# EAGLE schematic control_board (EAGLE 9.6.2)
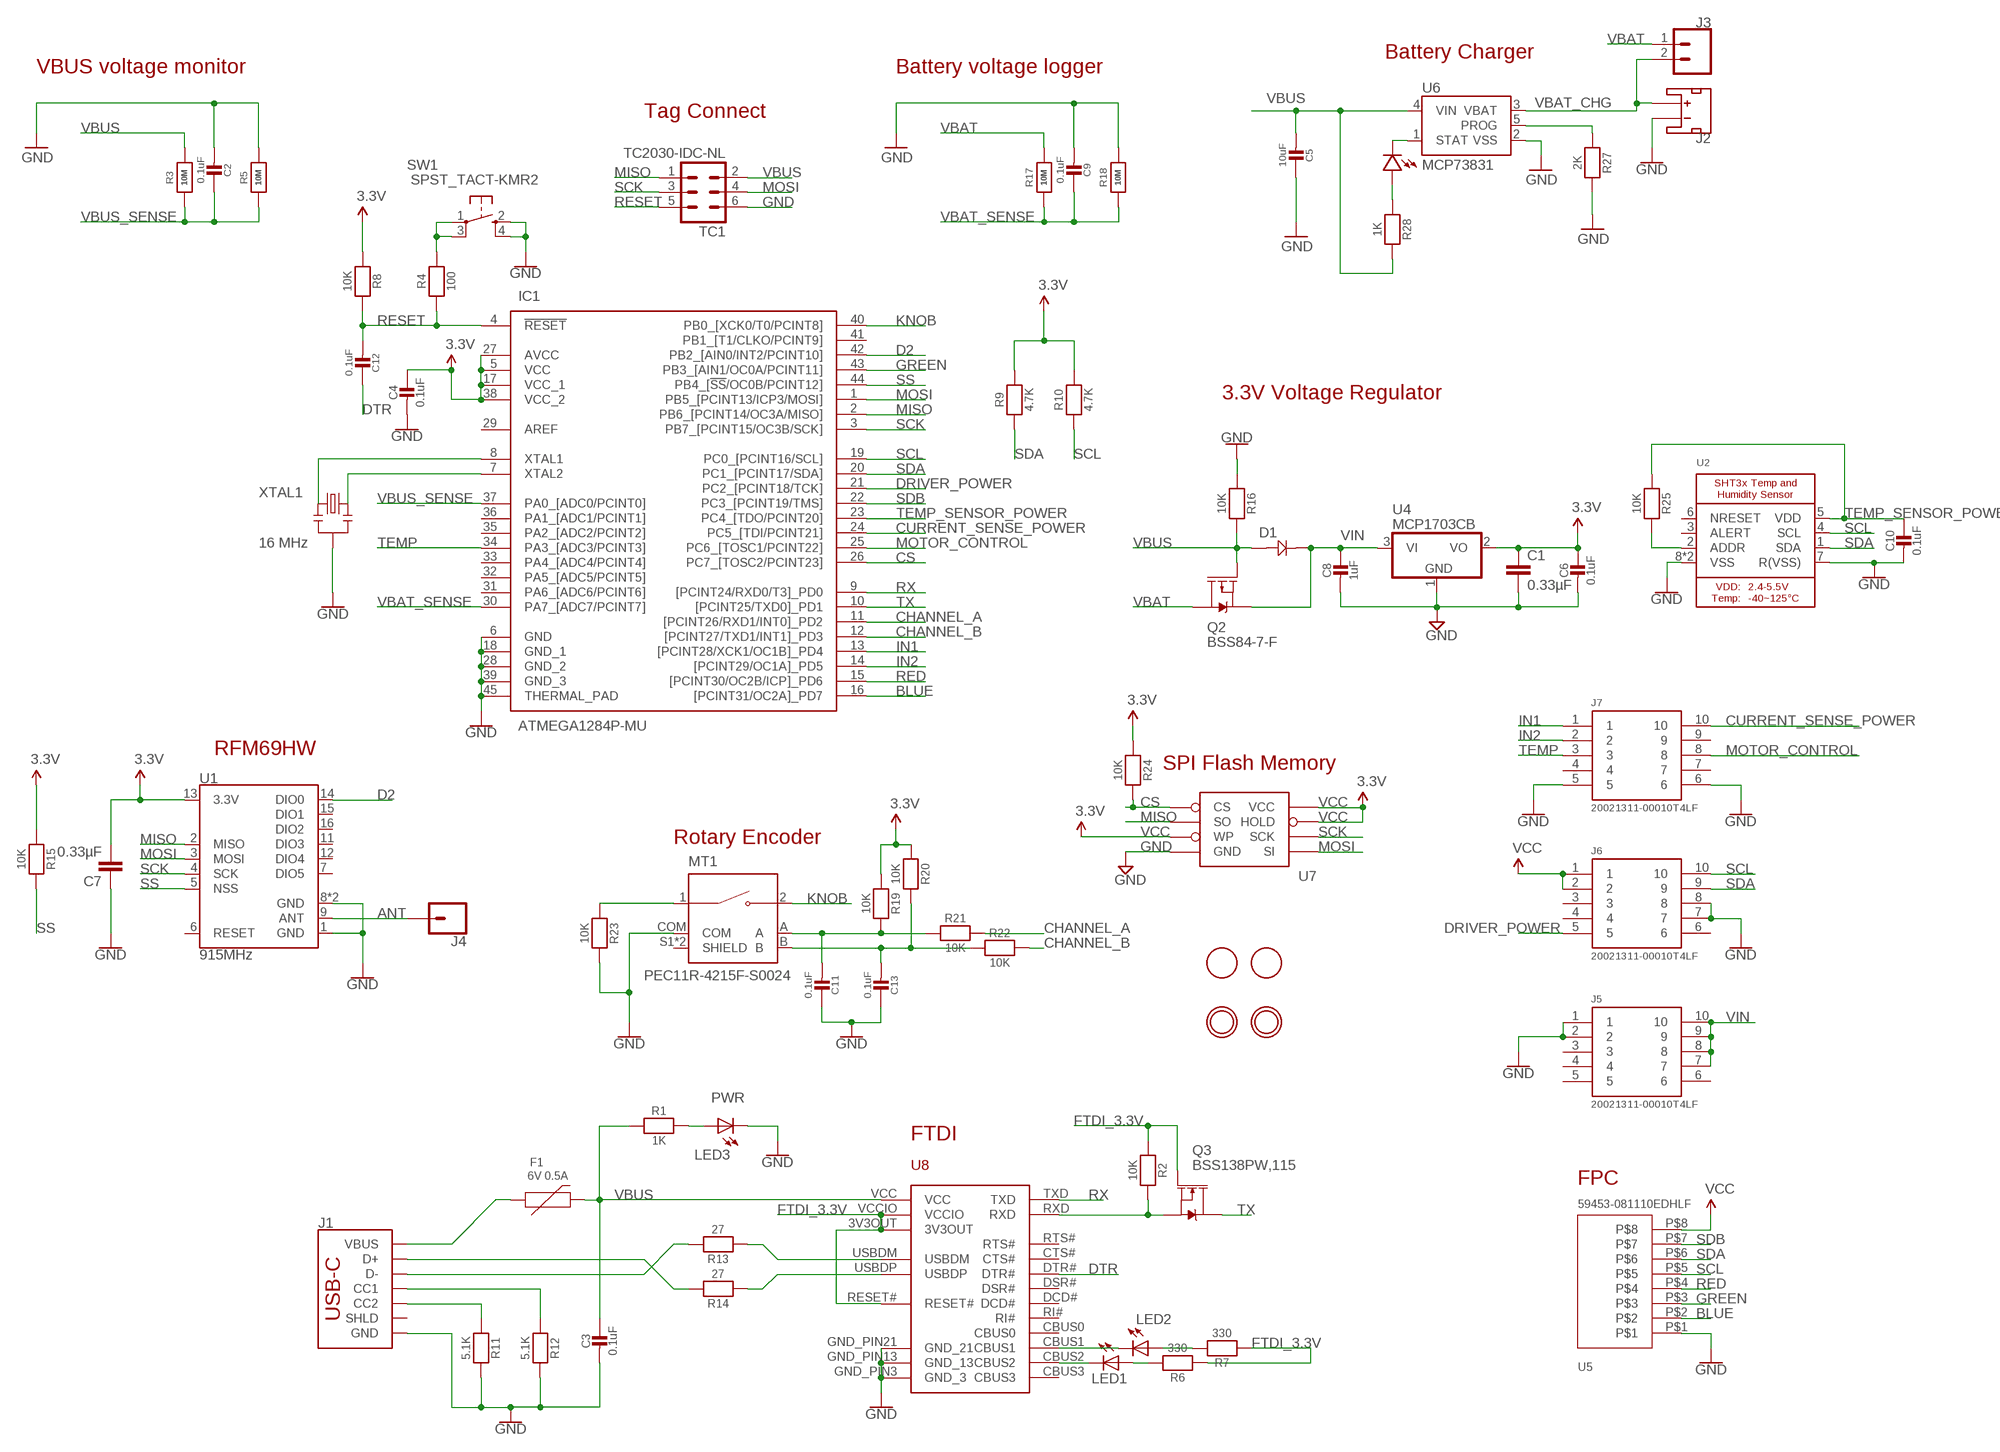
[diagram p0: schematic, sheet 1]

## Parts
C1  0.33µF  0.33UF/330NF-0805-50V-10%  [0805]
C2  0.1uF  MICROBUILDER_CAP_CERAMIC_0402MP  [MICROBUILDER__0402MP]
C3  0.1uF  MICROBUILDER_CAP_CERAMIC_0402MP  [MICROBUILDER__0402MP]
C4  0.1uF  MICROBUILDER_CAP_CERAMIC_0402MP  [MICROBUILDER__0402MP]
C5  10uF  MICROBUILDER_CAP_CERAMIC_0402MP  [MICROBUILDER__0402MP]
C6  0.1uF  MICROBUILDER_CAP_CERAMIC_0402MP  [MICROBUILDER__0402MP]
C7  0.33µF  0.33UF/330NF-0805-50V-10%  [0805]
C8  1uF  MICROBUILDER_CAP_CERAMIC_0402MP  [MICROBUILDER__0402MP]
C9  0.1uF  MICROBUILDER_CAP_CERAMIC_0402MP  [MICROBUILDER__0402MP]
C10  0.1uF  MICROBUILDER_CAP_CERAMIC_0402MP  [MICROBUILDER__0402MP]
C11  0.1uF  MICROBUILDER_CAP_CERAMIC_0402MP  [MICROBUILDER__0402MP]
C12  0.1uF  MICROBUILDER_CAP_CERAMIC_0402MP  [MICROBUILDER__0402MP]
C13  0.1uF  MICROBUILDER_CAP_CERAMIC_0402MP  [MICROBUILDER__0402MP]
D1  DIODE_SCHOTTKY0805-RES  [0805]
F1  6V 0.5A  PPTC_6V500MA  [0805]
IC1  ATMEGA1284P-MU  [QFN50P700X700X100-45N]
J1  USB Female Type C Connector  USB_C_2-LAYER_PADS  [USB-C-16P-2LAYER-PADS]
J2  JST_2MM_MALE  [JST-2-SMD]
J3  CONN_02  [1X02]
J4  CONN_01  [1X01]
J5  20021311-00010T4LF  [HEADER_1.27MM_2X5]
J6  20021311-00010T4LF  [HEADER_1.27MM_2X5]
J7  20021311-00010T4LF  [HEADER_1.27MM_2X5]
LED1  LEDCHIPLED_0603  [CHIPLED_0603]
LED2  LEDCHIPLED_0603  [CHIPLED_0603]
LED3  PWR  LEDCHIPLED_0603  [CHIPLED_0603]
LED4  LED0603  [0603-LED]
MT1  PEC11R-4215F-S0024  [XDCR_PEC11R-4215F-S0024]
Q2  BSS84-7-F  MOSFET-PCH-BSS84  [SOT23-3]
Q3  BSS138PW,115  MOSFET-NCH-BSS138PW,115  [SOT323]
R1  1K  MICROBUILDER_RESISTOR_0402MP  [MICROBUILDER__0402MP]
R2  10K  MICROBUILDER_RESISTOR_0402MP  [MICROBUILDER__0402MP]
R3  10M  MICROBUILDER_RESISTOR_0402MP  [MICROBUILDER__0402MP]
R4  100  MICROBUILDER_RESISTOR_0402MP  [MICROBUILDER__0402MP]
R5  10M  MICROBUILDER_RESISTOR_0402MP  [MICROBUILDER__0402MP]
R6  330  MICROBUILDER_RESISTOR_0402MP  [MICROBUILDER__0402MP]
R7  330  MICROBUILDER_RESISTOR_0402MP  [MICROBUILDER__0402MP]
R8  10K  MICROBUILDER_RESISTOR_0402MP  [MICROBUILDER__0402MP]
R9  4.7K  MICROBUILDER_RESISTOR_0402MP  [MICROBUILDER__0402MP]
R10  4.7K  MICROBUILDER_RESISTOR_0402MP  [MICROBUILDER__0402MP]
R11  5.1K  MICROBUILDER_RESISTOR_0402MP  [MICROBUILDER__0402MP]
R12  5.1K  MICROBUILDER_RESISTOR_0402MP  [MICROBUILDER__0402MP]
R13  27  MICROBUILDER_RESISTOR_0402MP  [MICROBUILDER__0402MP]
R14  27  MICROBUILDER_RESISTOR_0402MP  [MICROBUILDER__0402MP]
R15  10K  MICROBUILDER_RESISTOR_0402MP  [MICROBUILDER__0402MP]
R16  10K  MICROBUILDER_RESISTOR_0402MP  [MICROBUILDER__0402MP]
R17  10M  MICROBUILDER_RESISTOR_0402MP  [MICROBUILDER__0402MP]
R18  10M  MICROBUILDER_RESISTOR_0402MP  [MICROBUILDER__0402MP]
R19  10K  MICROBUILDER_RESISTOR_0402MP  [MICROBUILDER__0402MP]
R20  10K  MICROBUILDER_RESISTOR_0402MP  [MICROBUILDER__0402MP]
R21  10K  MICROBUILDER_RESISTOR_0402MP  [MICROBUILDER__0402MP]
R22  10K  MICROBUILDER_RESISTOR_0402MP  [MICROBUILDER__0402MP]
R23  10K  MICROBUILDER_RESISTOR_0402MP  [MICROBUILDER__0402MP]
R24  10K  MICROBUILDER_RESISTOR_0402MP  [MICROBUILDER__0402MP]
R25  10K  MICROBUILDER_RESISTOR_0402MP  [MICROBUILDER__0402MP]
R27  2K  MICROBUILDER_RESISTOR_0402MP  [MICROBUILDER__0402MP]
R28  1K  MICROBUILDER_RESISTOR_0402MP  [MICROBUILDER__0402MP]
SW1  SPST_TACT-KMR2  [KMR2]
TC1  TC2030-IDC-NL  [TC2030-IDC-NL]
U1  915MHz  RFM69HCW-915  [RFM69HCW-XXXS2]
U2  SHT3X  [SHT3X]
U4  MCP1703CB  [SOT23]
U5  59453-081110EDHLF  [59453-081110EDHLF]
U6  MCP73831  [SOT23-5]
U7  AT25F512BJEDEC_3.9MM  [SO08]
U8  FT231XQ-R  [FTDI_FT231XQ-R_PACKAGE]
U$2  MOUNTINGHOLE2.5  [MOUNTINGHOLE_2.5_PLATED]
U$3  MOUNTINGHOLE2.5  [MOUNTINGHOLE_2.5_PLATED]
U$8  FIDUCIAL  [FIDUCIAL_1MM]
U$9  FIDUCIAL  [FIDUCIAL_1MM]
XTAL1  16 MHz  RESONATORSMD  [RESONATOR-SMD]

## Nets
A: C11.2 MT1.A R19.2 R21.1
ANT: J4.1 U1.9(ANT)
B: C13.2 MT1.B R20.2 R22.1
BLUE: IC1.16([PCINT31/OC2A]_PD7) U5.P$2
CHANNEL_A: IC1.11([PCINT26/RXD1/INT0]_PD2) R21.2
CHANNEL_B: IC1.12([PCINT27/TXD1/INT1]_PD3) R22.2
CS: IC1.26(PC7_[TOSC2/PCINT23]) R24.2 U7.1_CS(CS)
CURRENT_SENSE_POWER: IC1.24(PC5_[TDI/PCINT21]) J7.10
D2: IC1.42(PB2_[AIN0/INT2/PCINT10]) U1.14(DIO0)
DRIVER_POWER: IC1.21(PC2_[PCINT18/TCK]) J6.5
DTR: C12.1 U8.DTR#
FTDI_3.3V: Q3.1(G) R2.1 R6.1 R7.1 U8.3V3OUT U8.RESET# U8.VCCIO
GND [power]: C1.2 C2.2 C3.2 C4.2 C5.1 C6.2 C7.1 C8.2 C9.2 C10.2 C11.1 C13.1 IC1.6(GND) IC1.18(GND_1) IC1.28(GND_2) IC1.39(GND_3) IC1.45(THERMAL_PAD) J1.GND J1.GND2(GND) J2.1(-) J5.1 J5.2 J6.7 J6.8 J7.5 J7.6 LED3.C MT1.COM R5.2 R11.2 R12.2 R16.1 R18.2 R23.2 R27.2 SW1.2(S) SW1.4(S1) TC1.6 U1.1(GND) U1.8(GND) U1.10(GND) U2.7(R(VSS)) U2.8(VSS) U2.THERMAL(VSS) U4.1(GND) U5.P$1 U6.2(VSS) U7.4_GND(GND) U8.GND_PIN3(GND_3) U8.GND_PIN13(GND_13) U8.GND_PIN21(GND_21) XTAL1.2
GREEN: IC1.43(PB3_[AIN1/OC0A/PCINT11]) U5.P$3
IN1: IC1.13([PCINT28/XCK1/OC1B]_PD4) J7.1
IN2: IC1.14([PCINT29/OC1A]_PD5) J7.2
KNOB: IC1.40(PB0_[XCK0/T0/PCINT8]) MT1.2
MISO: IC1.2(PB6_[PCINT14/OC3A/MISO]) TC1.1 U1.2(MISO) U7.2_SO(SO)
MOSI: IC1.1(PB5_[PCINT13/ICP3/MOSI]) TC1.4 U1.3(MOSI) U7.5_SI(SI)
MOTOR_CONTROL: IC1.25(PC6_[TOSC1/PCINT22]) J7.8
N$1: IC1.8(XTAL1) XTAL1.1
N$2: LED3.A R1.2
N$3: IC1.7(XTAL2) XTAL1.3
N$4: J1.B5(CC2) R11.1
N$5: J1.A5(CC1) R12.1
N$6: J1.A6(D+) J1.B6(D+) R14.2
N$7: J1.A7(D-) J1.B7(D-) R13.2
N$8: R14.1 U8.USBDP
N$9: R13.1 U8.USBDM
N$10: F1.1 J1.VBUS1(VBUS) J1.VBUS2(VBUS)
N$11: MT1.1 R23.1
N$12: R4.2 SW1.1(P) SW1.3(P1)
N$13: LED1.C U8.CBUS2
N$14: Q3.2(S) R2.2 U8.RXD
N$15: LED1.A R6.2
N$16: LED4.PLUS R28.1
N$17: LED2.A R7.2
N$18: LED2.C U8.CBUS1
N$19: LED4.MINUS U6.1(STAT)
N$20: R25.2 U2.2(ADDR)
PROG1: R27.1 U6.5(PROG)
RED: IC1.15([PCINT30/OC2B/ICP]_PD6) U5.P$4
RESET: C12.2 IC1.4(!RESET) R4.1 R8.2 TC1.5
RX: IC1.9([PCINT24/RXD0/T3]_PD0) U8.TXD
SCK: IC1.3(PB7_[PCINT15/OC3B/SCK]) TC1.3 U1.4(SCK) U7.6_SCK(SCK)
SCL: IC1.19(PC0_[PCINT16/SCL]) J6.10 R10.1 U2.4(SCL) U5.P$5
SDA: IC1.20(PC1_[PCINT17/SDA]) J6.9 R9.1 U2.1(SDA) U5.P$6
SDB: IC1.22(PC3_[PCINT19/TMS]) U5.P$7
SS: IC1.44(PB4_[!SS!/OC0B/PCINT12]) R15.2 U1.5(NSS)
TEMP: IC1.34(PA3_[ADC3/PCINT3]) J7.3
TEMP_SENSOR_POWER: C10.1 IC1.23(PC4_[TDO/PCINT20]) R25.1 U2.5(VDD)
TX: IC1.10([PCINT25/TXD0]_PD1) Q3.3(D)
VBAT: J3.1 Q2.3(D1) R17.2
VBAT_CHG: J2.2(+) J3.2 U6.3(VBAT)
VBAT_SENSE: C9.1 IC1.30(PA7_[ADC7/PCINT7]) R17.1 R18.1
VBUS [power]: C3.1 C5.2 D1.1 F1.2 Q2.1(G1) R1.1 R3.2 R16.2 R28.2 TC1.2 U6.4(VIN) U8.VCC
VBUS_SENSE: C2.1 IC1.37(PA0_[ADC0/PCINT0]) R3.1 R5.1
VCC: C1.1 C4.1 C6.1 C7.2 IC1.5(VCC) IC1.17(VCC_1) IC1.27(AVCC) IC1.38(VCC_2) J6.1 J6.2 R8.1 R9.2 R10.2 R15.1 R19.1 R20.1 R24.1 U1.13(3.3V) U4.2(VO) U5.P$8 U7.3_WP(WP) U7.7_HOLD(HOLD) U7.8_VCC(VCC) ; supply symbol labelled 3.3V
VIN [power]: C8.1 D1.2 J5.7 J5.8 J5.9 J5.10 Q2.2(S1) U4.3(VI)
Unconnected: IC1.29(AREF) IC1.31(PA6_[ADC6/PCINT6]) IC1.32(PA5_[ADC5/PCINT5]) IC1.33(PA4_[ADC4/PCINT4]) IC1.35(PA2_[ADC2/PCINT2]) IC1.36(PA1_[ADC1/PCINT1]) IC1.41(PB1_[T1/CLKO/PCINT9]) J1.SHLD1(SHLD) J1.SHLD2(SHLD) J1.SHLD3(SHLD) J1.SHLD4(SHLD) J2.NC1(PAD1) J2.NC2(PAD2) J5.3 J5.4 J5.5 J5.6 J6.3 J6.4 J6.6 J7.4 J7.7 J7.9 MT1.S1(SHIELD) MT1.S2(SHIELD) U1.6(RESET) U1.7(DIO5) U1.11(DIO3) U1.12(DIO4) U1.15(DIO1) U1.16(DIO2) U2.3(ALERT) U2.6(NRESET) U8.CBUS0 U8.CBUS3 U8.CTS# U8.DCD# U8.DSR# U8.RI# U8.RTS#

## Notes on the sheet
- Battery Charger
- VBUS voltage monitor | Battery voltage logger
- Tag Connect
- 3.3V Voltage Regulator
- RFM69HW
- SPI Flash Memory
- Rotary Encoder
- FTDI
- FPC

## Library data of the parts
C1 C7 = SparkFun-Capacitors:0.33UF/330NF: 0.33µF/330nF ceramic capacitors A capacitor is a passive two-terminal electrical component used to store electrical energy temporarily in an electric field.; PROD_ID: CAP-08469
C2-C6 C8-C13 = Adafruit Feather 32u4 Bluefruit LE:MICROBUILDER_CAP_CERAMIC: Ceramic Capacitors For new designs, use the packages preceded by an '_' character since they are more reliable: The following footprints should be used on most boards: _0402 - Standard footprint for regular board layouts _0603 - Standard footprint for regular board layouts _0805 - Standard footprint for regular board layouts _1206 - Standard footprint for regular board layouts For extremely tight-pitch boards where space is at a premium, the following 'micro-pitch' footprints can be used (smaller pads, no silkscreen outline, etc.): _0402MP - Micro-pitch footprint for very dense/compact boards _0603MP - Micro-pitch footprint for very dense/compact boards _0805MP - Micro-pitch footprint for very dense/compact boards _1206MP - Micro-pitch footprint for very dense/compact boards; MPN: GRM155R71C104KA88J
D1 = SCHOTTKY_0805:DIODE_SCHOTTKY
F1 = SparkFun-Fuses:PPTC: Resettable Fuse PPTC Resettable Fuse. Really a sort of resistor with a polymeric positive temperature coefficient whose resistance increases dramatically with an increase in temperature. When heated by the power passing through the resistance rises causing the current to be limited, protecting the circuit. This is achieved by the transition of the polymer from a crystalline to an amorphous state where the conductive carbon separates breaking the conductive pathways found in the cool crystalline structure. When a PPTC cools back down it resumes conducting letting the circuit turn back on. SparkFun Products: SparkFun RedBoard - Programmed with Arduino <https://www.sparkfun.com/products/12757> Pro Micro - 5V/16MHz <https://www.sparkfun.com/products/12640> Arduino Pro 328 - 5V/16MHz <https://www.sparkfun.com/products/10915> MP3 Trigger <https://www.sparkfun.com/products/13720>; MPN: MF-PSML110-2; PROD_ID: RES-13945
IC1 = ATMEGA1284P-MU:ATMEGA1284P-MU: ATMEGA1284P-MU, 8 bit AVR Microcontroller 20MHz 4, 128kb Flash, 16kb RAM, I2C SPI 44-Pin VQFN Source: Datasheet <https://componentsearchengine.com/Datasheets/1/ATMEGA1284P-MU.pdf> Check prices <https://pricing.snapeda.com/parts/ATMEGA1284P-MU/Microchip/view-part?ref=eda>; AVAILABILITY: Warning; DESCRIPTION: AVR AVR® ATmega Microcontroller IC 8-Bit 20MHz 128KB (64K x 16) FLASH 44-VQFN (7x7); MF: Microchip; MP: ATMEGA1284P-MU; PACKAGE: VQFN-44 Microchip; PRICE: None; PURCHASE-URL: https://pricing.snapeda.com/search/part/ATMEGA1284P-MU/?ref=eda
J1 = SparkFun-Connectors:USB_C: USB Type C 16Pin Connector Super Speed pins not available on the 16-pin purely SMD connector so this part is best for USB 2.0 implementations. D1 and D2 are tied together enabling D+/- no matter which way the cable is plugged into the connector. The two channel configuration pins (CC1/2) are exposed. These are normally connected to ground via 5.1k resistors but can be reconfigured for high current/high power applications. **4-LAYER BOARD WARNING!!** If designing 4-layer board, make sure to select the variant _4-LAYER-ISOLATED. The linked footprint (USB-C-16-4LAYER-ISOLATED) includes some very necessary cutout polygons in the inner layers (2 and 15). This prevents the PTH mounting shield legs on the USB connector from electrically connecting any other polygons on the inner layers (usually VCC and GND).; PROD_ID: CONN-14122
J2 = SparkFun-Connectors:JST_2MM_MALE: JST 2MM MALE RA CONNECTOR Two pin, compact surface mount connector. Commonly used as a battery input connection point. We really like the solid locking feeling and high current rating on these small connectors. We use these all the time as battery connectors. Mates to single-cell LiPo batteries. Here is the connector we sell at SparkFun: JST Right Angle Connector - White <https://www.sparkfun.com/products/8612> (PRT-08612) Datasheet <http://www.sparkfun.com/datasheets/Prototyping/Connectors/JST-Horizontal.pdf> It was used on these SparkFun products: SparkFun MOSFET Power Controller <https://www.sparkfun.com/products/11214> (PRT-11214) SparkFun Battery Babysitter - LiPo Battery Manager <https://www.sparkfun.com/products/13777> (PRT-13777) And many, many others that required a lipo battery connection.; PROD_ID: CONN-11443; SF_ID: PRT-08612
J3 = SparkFun-Connectors:CONN_02: Multi connection point. Often used as Generic Header-pin footprint for 0.1 inch spaced/style header connections On any of the 0.1 inch spaced packages, you can populate with these: Break Away Headers - Straight <https://www.sparkfun.com/products/116> (PRT-00116) Break Away Male Headers - Right Angle <https://www.sparkfun.com/products/553> (PRT-00553) Female Headers <https://www.sparkfun.com/products/115> (PRT-00115) Break Away Headers - Machine Pin <https://www.sparkfun.com/products/117> (PRT-00117) Break Away Female Headers - Swiss Machine Pin <https://www.sparkfun.com/products/743> (PRT-00743) For SCREWTERMINALS and SPRING TERMINALS visit here: Screw Terimnals on SparkFun.com <https://www.sparkfun.com/search/results?term=Screw+Terminals> (5mm/3.5mm/2.54mm spacing) This device is also useful as a general connection point to wire up your design to another part of your project. Our various solder wires solder well into these plated through hole pads. Hook-Up Wire - Assortment (Stranded, 22 AWG) <https://www.sparkfun.com/products/11375> (PRT-11375) Hook-Up Wire - Assortment (Solid Core, 22 AWG) <https://www.sparkfun.com/products/11367> (PRT-11367) View the entire wire category on our website here <https://www.sparkfun.com/categories/141> Special notes: Molex polarized connector foot print use with: PRT-08233 with associated crimp pins and housings. 2.54_SCREWTERM for use with PRT-10571. 3.5mm Screw Terminal footprints for PRT-08084 5mm Screw Terminal footprints for use with PRT-08432
J4 = SparkFun-Connectors:CONN_01: Single connection point. Often used as Generic Header-pin footprint for 0.1 inch spaced/style header connections On any of the 0.1 inch spaced packages, you can populate with these: Break Away Headers - Straight <https://www.sparkfun.com/products/116> (PRT-00116) Break Away Male Headers - Right Angle <https://www.sparkfun.com/products/553> (PRT-00553) Female Headers <https://www.sparkfun.com/products/115> (PRT-00115) Break Away Headers - Machine Pin <https://www.sparkfun.com/products/117> (PRT-00117) Break Away Female Headers - Swiss Machine Pin <https://www.sparkfun.com/products/743> (PRT-00743) This device is also useful as a general connection point to wire up your design to another part of your project. Our various solder wires solder well into these plated through hole pads. Hook-Up Wire - Assortment (Stranded, 22 AWG) <https://www.sparkfun.com/products/11375> (PRT-11375) Hook-Up Wire - Assortment (Solid Core, 22 AWG) <https://www.sparkfun.com/products/11367> (PRT-11367) View the entire wire category on our website here <https://www.sparkfun.com/categories/141> Special notes: SMTSO-256-ET is a "flush mount" nut for a 4-40 screw. We mostly use this on specialty testbeds; it is a nice way to connect hardware to your PCB at an adjustable hieght. Also note, the SNAP packages are for using a snappable style connector. We sell a baggie of snaps and they are also used on two LilyPad designs: Snap Assortment - 30 pack (male and female) <https://www.sparkfun.com/products/11347> (DEV-11347) LilyPad Arduino SimpleSnap <https://www.sparkfun.com/products/10941> (DEV-10941) LilyPad SimpleSnap Protoboard <https://www.sparkfun.com/products/10940> (DEV-10940)
J5-J7 = Amphenol:20021311-00010T4LF
LED1-LED3 = adafruit:LED: LED OSRAM: - CHIPLED LG R971, LG N971, LY N971, LG Q971, LY Q971, LO R971, LY R971 LH N974, LH R974 LS Q976, LO Q976, LY Q976 LO Q996 - Hyper CHIPLED LW Q18S LB Q993, LB Q99A, LB R99A - SideLED LS A670, LO A670, LY A670, LG A670, LP A670 LB A673, LV A673, LT A673, LW A673 LH A674 LY A675 LS A676, LA A676, LO A676, LY A676, LW A676 LS A679, LY A679, LG A679 - Hyper Micro SIDELED® LS Y876, LA Y876, LO Y876, LY Y876 LT Y87S - SmartLED LW L88C, LW L88S LB L89C, LB L89S, LG L890 LS L89K, LO L89K, LY L89K LS L896, LA L896, LO L896, LY L896 - TOPLED LS T670, LO T670, LY T670, LG T670, LP T670 LSG T670, LSP T670, LSY T670, LOP T670, LYG T670 LG T671, LOG T671, LSG T671 LB T673, LV T673, LT T673, LW T673 LH T674 LS T676, LA T676, LO T676, LY T676, LB T676, LH T676, LSB T676, LW T676 LB T67C, LV T67C, LT T67C, LS T67K, LO T67K, LY T67K, LW E67C LS E67B, LA E67B, LO E67B, LY E67B, LB E67C, LV E67C, LT E67C LW T67C LS T679, LY T679, LG T679 LS T770, LO T770, LY T770, LG T770, LP T770 LB T773, LV T773, LT T773, LW T773 LH T774 LS E675, LA E675, LY E675, LS T675 LS T776, LA T776, LO T776, LY T776, LB T776 LHGB T686 LT T68C, LB T68C - Hyper Mini TOPLED® LB M676 - Mini TOPLED Santana® LG M470 LS M47K, LO M47K, LY M47K Source: http://www.osram.convergy.de/
LED4 = LowPowerLab:LED
MT1 = PEC11R-4215F-S0024:PEC11R-4215F-S0024: Incremental Encoder, 12 Mm, Contact Rating 10 Ma - 5 Vdc Check prices <https://pricing.snapeda.com/parts/PEC11R-4215F-S0024/Bourns/view-part?ref=eda>; AVAILABILITY: Warning; DESCRIPTION: Rotary Encoder Mechanical 24 Quadrature (Incremental) Vertical; MF: Bourns; MP: PEC11R-4215F-S0024; PACKAGE: None; PRICE: None; PURCHASE-URL: https://pricing.snapeda.com/search/part/PEC11R-4215F-S0024/?ref=eda
Q2 = MOSFETs:MOSFET-PCH: P-channel MOSFETs SOT23-3 and SOT323 (SC70) packages Designed by AKstudios
Q3 = MOSFETs:MOSFET-NCH: N-channel MOSFETs SOT23-3 and SOT323 (SC70) packages Designed by AKstudios
R1 R2 R4 R6-R16 R19-R25 R27 R28 = Adafruit Feather 32u4 Bluefruit LE:MICROBUILDER_RESISTOR: Resistors For new designs, use the packages preceded by an '_' character since they are more reliable: The following footprints should be used on most boards: _0402 - Standard footprint for regular board layouts _0603 - Standard footprint for regular board layouts _0805 - Standard footprint for regular board layouts _1206 - Standard footprint for regular board layouts For extremely tight-pitch boards where space is at a premium, the following 'micro-pitch' footprints can be used (smaller pads, no silkscreen outline, etc.): _0402MP - Micro-pitch footprint for very dense/compact boards _0603MP - Micro-pitch footprint for very dense/compact boards _0805MP - Micro-pitch footprint for very dense/compact boards _1206MP - Micro-pitch footprint for very dense/compact boards; MPN: RC0402FR-7W10KL
R3 R5 R17 R18 = Adafruit Feather 32u4 Bluefruit LE:MICROBUILDER_RESISTOR: Resistors For new designs, use the packages preceded by an '_' character since they are more reliable: The following footprints should be used on most boards: _0402 - Standard footprint for regular board layouts _0603 - Standard footprint for regular board layouts _0805 - Standard footprint for regular board layouts _1206 - Standard footprint for regular board layouts For extremely tight-pitch boards where space is at a premium, the following 'micro-pitch' footprints can be used (smaller pads, no silkscreen outline, etc.): _0402MP - Micro-pitch footprint for very dense/compact boards _0603MP - Micro-pitch footprint for very dense/compact boards _0805MP - Micro-pitch footprint for very dense/compact boards _1206MP - Micro-pitch footprint for very dense/compact boards; MPN: RC0402JR-0710KL
SW1 = adafruit:SPST_TACT: SMT 6mm switch, EVQQ2 series http://www.ladyada.net/library/eagle
TC1 = TagConnect:TC2030-IDC: Tag-Connect In Circuit Programming & Debug Cable 6 Pin http://www.tag-connect.com
U1 = SparkFun-RF:RFM69H: Hope RF RFM69H ISM Transceiver Module The RFM69H is a transceiver module capable of operation over a wide frequency range, including the 315,433,868 and 915MHz license-free ISM (Industry Scientific and Medical) frequency bands. All major RF communication parameters are programmable and most of them can be dynamically set. The RFM69H offers the unique advantage of programmable narrow-band and wide- band communication modes. The RFM69H is optimized for low power consumption while offering high RF output power and channelized operation.Compliance ETSI and FCC regulations. Datasheet <http://www.hoperf.cn/upload/docs/RF/SX/RFM69H_DataSheet_v1.3.pdf> SparkFun Products RFM69HCW Wireless Transceiver - 915MHz <https://www.sparkfun.com/products/13909> (COM-13909) RFM69HCW Wireless Transceiver - 434MHz <https://www.sparkfun.com/products/13910> (COM-13910) SparkFun RFM69 Breakout (915MHz) <https://www.sparkfun.com/products/12775> (WRL-12775) SparkFun RFM69 Breakout (434MHz) <https://www.sparkfun.com/products/12823> (WRL-12823); PROD_ID: IC-11997
U2 = SHT31:SHT3X: SHT3x - Digital Temperature and Humidity Sensor Supply Voltage: 2.4-5.5V Humidity Accuracy: SHT30 = +/-3%RH, SHT31 = +/-2%RH Temperature Sensor: -40~125°C (+/-0.3°C from 10-55C)
U4 = linear:MCP1703: 250 mA, 16V, Low Quiescent Current LDO Regulator Source: http://ww1.microchip.com/downloads/en/DeviceDoc/22049b.pdf
U5 = 59453-081110EDHLF:59453-081110EDHLF: FPC Bottom connector 8 position 0.5mm R/A MPN: 59453-081110EDHLF Designed by AKstudios github.com/akstudios
U6 = SparkFun:MCP73831: Microchip's MCP73831 Miniature single cell, fully integrated Li-Ion, Li-polymer charge management controller http://ww1.microchip.com/downloads/en/DeviceDoc/21984a.pdf
U7 = LowPowerLab:AT25F512B: 4-Mbit SPI flash memory
U8 = ftdi_ft231xq-r:FT231XQ-R: This is the 20-LD QFN package of the FTDI FT231XQ-R chip.
U$2 U$3 = ADS1x15:MOUNTINGHOLE: Mounting Hole For #2 screws (0.086"/2.18mm width, 0.094"/2.4mm hole) use 2.5mm
U$8 U$9 = adafruit:FIDUCIAL: For use by pick and place machines to calibrate the vision/machine, 1mm By microbuilder.eu
XTAL1 = SparkFun:RESONATOR: Resonator Small SMD resonator. This is the itty bitty 10/20MHz resonators with built in caps. CSTCE10M0G55 and CSTCE20M0V53. Footprint has been reviewed closely but hasn't been tested yet.

## Net classes
1 power: width 0.381 mm, clearance 0.254 mm